# Altium schematic sheet Power.SchDoc: POWER
size 297 x 209 mm; SheetNumber: 1; SheetTotal: 2
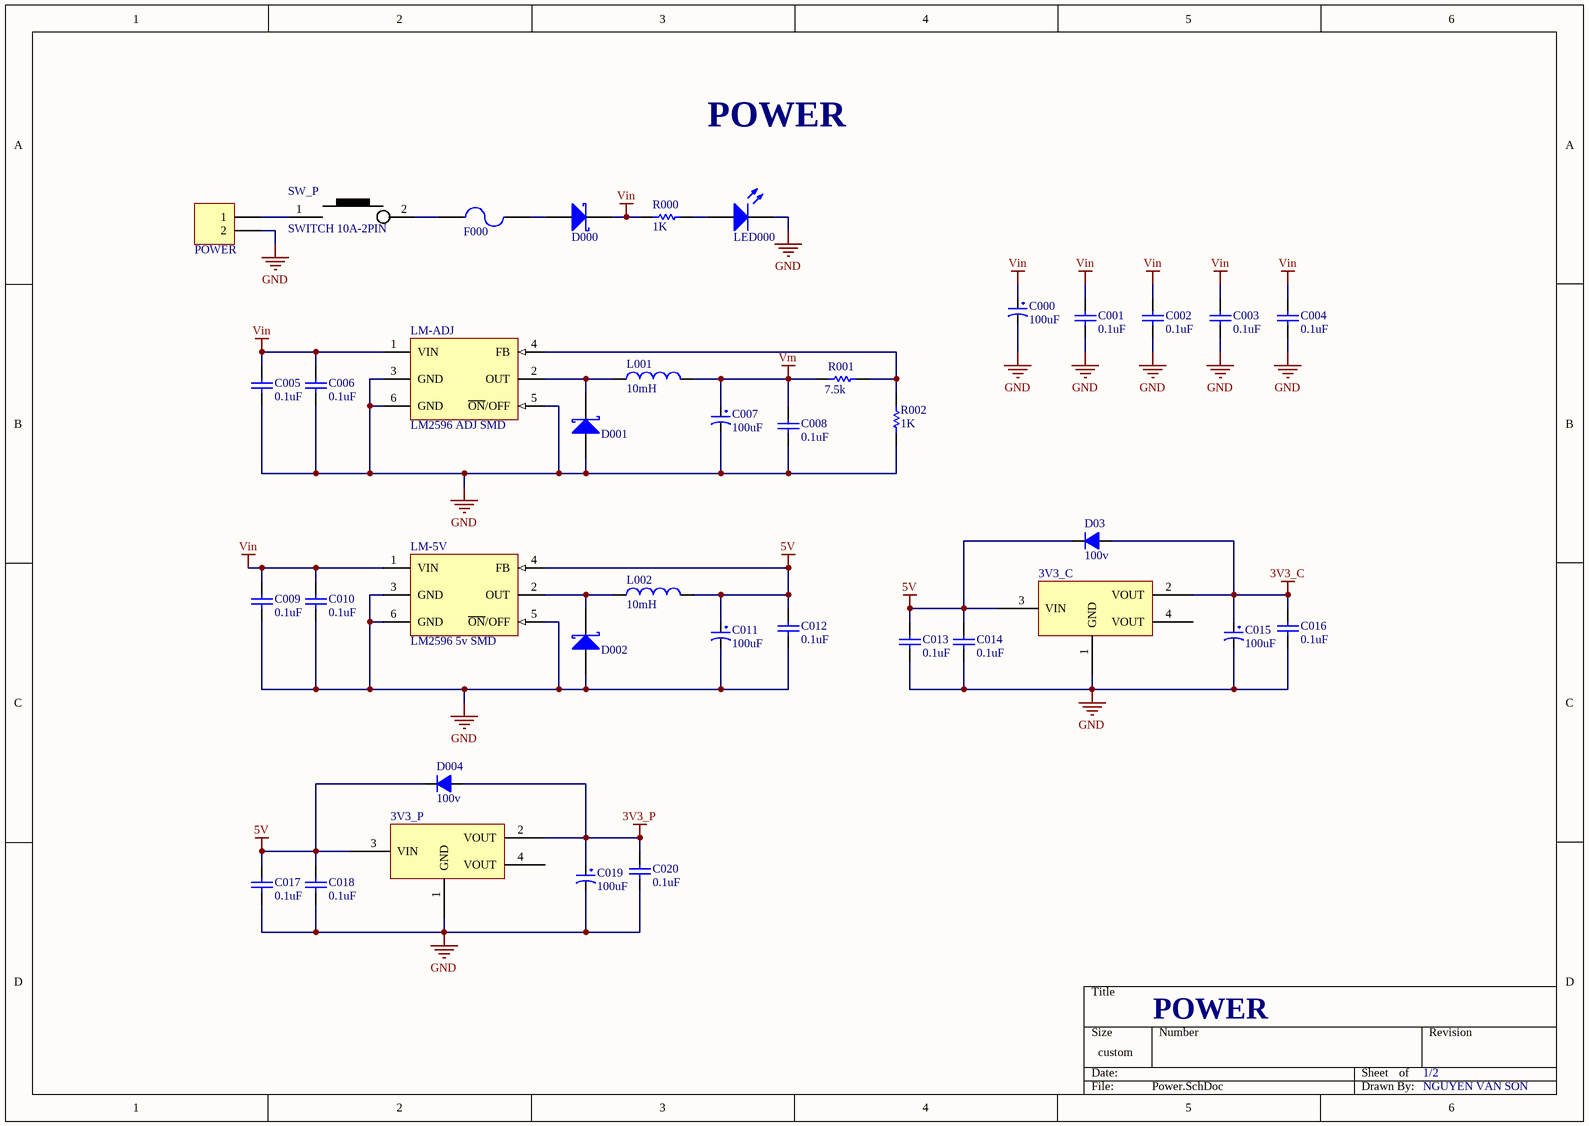
[diagram p0: Power.SchDoc]

## Parts
3V3_C  AMS1117-3.3V  [SOT223]  (value not drawn)
3V3_P  AMS1117-3.3V  [SOT223]  (value not drawn)
C000  100uF  [tu tantalum smd7343]
C001  value 0.1uF  [CAP-SM-0603]  (hidden comment: Cap Non-Pol SMD)
C002  value 0.1uF  [CAP-SM-0603]  (hidden comment: Cap Non-Pol SMD)
C003  value 0.1uF  [CAP-SM-0603]  (hidden comment: Cap Non-Pol SMD)
C004  value 0.1uF  [CAP-SM-0603]  (hidden comment: Cap Non-Pol SMD)
C005  value 0.1uF  [CAP-SM-0603]  (hidden comment: Cap Non-Pol SMD)
C006  value 0.1uF  [CAP-SM-0603]  (hidden comment: Cap Non-Pol SMD)
C007  100uF  [tu tantalum smd3528]
C008  value 0.1uF  [CAP-SM-0603]  (hidden comment: Cap Non-Pol SMD)
C009  value 0.1uF  [CAP-SM-0603]  (hidden comment: Cap Non-Pol SMD)
C010  value 0.1uF  [CAP-SM-0603]  (hidden comment: Cap Non-Pol SMD)
C011  100uF  [tu tantalum smd3528]
C012  value 0.1uF  [CAP-SM-0603]  (hidden comment: Cap Non-Pol SMD)
C013  value 0.1uF  [CAP-SM-0603]  (hidden comment: Cap Non-Pol SMD)
C014  value 0.1uF  [CAP-SM-0603]  (hidden comment: Cap Non-Pol SMD)
C015  100uF  [tu tantalum smd3528]
C016  value 0.1uF  [CAP-SM-0603]  (hidden comment: Cap Non-Pol SMD)
C017  value 0.1uF  [CAP-SM-0603]  (hidden comment: Cap Non-Pol SMD)
C018  value 0.1uF  [CAP-SM-0603]  (hidden comment: Cap Non-Pol SMD)
C019  100uF  [tu tantalum smd3528]
C020  value 0.1uF  [CAP-SM-0603]  (hidden comment: Cap Non-Pol SMD)
D000  D Schottky  [SS34]  (value not drawn)
D001  D Schottky  [SS34]  (value not drawn)
D002  D Schottky  [SS34]  (value not drawn)
D03  100v  [DIODE SMA]
D004  100v  [DIODE SMA]
F000  Fuse  [FUSE SMD]  (value not drawn)
L001  value 10mH  [INDUCTOR 12.5x12.5]  (hidden comment: Inductor)
L002  value 10mH  [INDUCTOR 12.5x12.5]  (hidden comment: Inductor)
LED000  LED SMD  [LED_0805_Blue]  (value not drawn)
LM-5V  LM2596 5v SMD  [TO263-5]
LM-ADJ  LM2596 ADJ SMD  [TO263-5]
POWER  Domino 2  [DOMINO SMALL 2]  (value not drawn)
R000  value 1K  [RES-SM-0603]  (hidden comment: RESISTOR SMD)
R001  value 7.5k  [RES-SM-0603]  (hidden comment: RESISTOR SMD)
R002  value 1K  [RES-SM-0603]  (hidden comment: RESISTOR SMD)
SW_P  SWITCH 10A-2PIN  [SW_2ARS_TH]

## Nets
3V3_C: 3V3_C.2(VOUT) C015.1 C016.2 D03.1(A)
3V3_P: 3V3_P.2(VOUT) C019.1 C020.2 D004.1(A)
5V: 3V3_C.3(VIN) 3V3_P.3(VIN) C011.1 C012.2 C013.2 C014.2 C017.2 C018.2 D03.2(K) D004.2(K) L002.2 LM-5V.4(FB)
GND: 3V3_C.1(GND) 3V3_P.1(GND) C000.2 C001.1 C002.1 C003.1 C004.1 C005.1 C006.1 C007.2 C008.1 C009.1 C010.1 C011.2 C012.1 C013.1 C014.1 C015.2 C016.1 C017.1 C018.1 C019.2 C020.1 D001.1(A) D002.1(A) LED000.2(K) LM-5V.3(GND) LM-5V.5(~{ON}/OFF) LM-5V.6(GND) LM-ADJ.3(GND) LM-ADJ.5(~{ON}/OFF) LM-ADJ.6(GND) POWER.2 R002.2
Vin: C000.1 C001.2 C002.2 C003.2 C004.2 C005.2 C006.2 C009.2 C010.2 D000.2(K) LM-5V.1(VIN) LM-ADJ.1(VIN) R000.1
Vm: C007.1 C008.2 L001.2 R001.2
NetD000_1: D000.1(A) F000.2
NetD001_2: D001.2(K) L001.1 LM-ADJ.2(OUT)
NetD002_2: D002.2(K) L002.1 LM-5V.2(OUT)
NetF000_1: F000.1 SW_P.2
NetLED000_1: LED000.1(A) R000.2
NetLM-ADJ_4: LM-ADJ.4(FB) R001.1 R002.1
NetPOWER_1: POWER.1 SW_P.1

Not connected (* = marked no-connect by the designer): 3V3_C 4(VOUT); 3V3_P 4(VOUT)

## Notes on the sheet
- POWER
- 1/2
- NGUYEN VAN SON

## Library data of the parts
3V3_C 3V3_P = AMS1117 SMD: Dán; Value: AMS1117-3.3V SOT223; Don_Vi: Con; Ma_Hang: MH000596; Ghi_Chu: *; Kieu_Chan: *; Chung_Loai: Dán
C000 C007 = Tu tantalum 100uF 50V SMD7343: Dán; Don_Vi: Con; So_Chan: 2; Ten_Linh_Kien: Tụ tantalum 107T-100uF 50V SMD7343; Ma_Hang: MH008401; Chung_Loai: Dán; Kieu_Chan: *
C001 C002 C003 C004 C005 C006 C008 C009 C010 C012 C013 C014 C016 C017 C018 C020 = Cap Non-Pol SMD: Capacitor
C011 = Tu tantalum 100uF 10V SMD6032: Dán; Don_Vi: Con; So_Chan: 2; Ten_Linh_Kien: Tụ tantalum 107A-100uF 10V SMD6032; Ma_Hang: MH007594; Chung_Loai: Dán; Kieu_Chan: *
C015 C019 = Tu tantalum 100uF 6.3V SMD3528: Dán; Don_Vi: Con; So_Chan: 2; Ten_Linh_Kien: Tụ tantalum 107J-100uF 6.3V SMD3528; Ma_Hang: MH007595; Chung_Loai: Dán; Kieu_Chan: *
D000 D001 D002 = D Schottky: Schottky Diode; Published: 8-Jun-2000; LatestRevisionDate: 17-Jul-2002; LatestRevisionNote: Re-released for DXP Platform.; PackageReference: SMB; Publisher: Altium Limited; PackageDescription: DO-214-AA/SMB; 2 C-Bend Leads; Body 5.3 x 3.6 mm, inc. leads (LxW); Code_JEDEC: DO-214-AA
D03 D004 = Diode 1N4007: Cắm; Ten_Linh_Kien: Diode 1N4007 1A (DIP); Don_Vi: Con; Ma_Hang: MH001063; Ghi Chu: *; Kieu_Chan: *; Chung_Loai: Cắm
LED000 = LED SMD: LED
LM-5V LM-ADJ = LM2576 3.3V SMD: Dán; Don_Vi: Con; Ma_Hang: MH001260; Ten_Linh_Kien: LM2576S-3.3V BUCK 3.3V 3A TO263-5; Ghi_Chu: *; Kieu_Chan: *; Chung_Loai: Dán
POWER = Domino 2: Domino, 2-Pin; LatestRevisionDate: 17-Jul-2002; LatestRevisionNote: Re-released for DXP Platform.; Publisher: Altium Limited
R000 R001 R002 = RESISTOR SMD: Resistor
SW_P = SW1_RS-471005264153-TH: Rocker Switch SPST 16A (AC), 10A (DC) 250V Panel Mount, Snap-In; Manufacturer: Würth Elektronik; Alternate Part Number-1: NA; Manufacturer Part Number: 471005264153; Case/Package: TH; Supplier-1: Würth Elektronik; Supplier Part Number-1: 471005264153